# Altium schematic sheet 04-RFID.SchDoc: RFID
size A4; Engineer: Juan M Garin; Organization: ESO; Address1: Juan M Garin; DocumentNumber: 4; Revision: 1.0; SheetNumber: 4; SheetTotal: 6
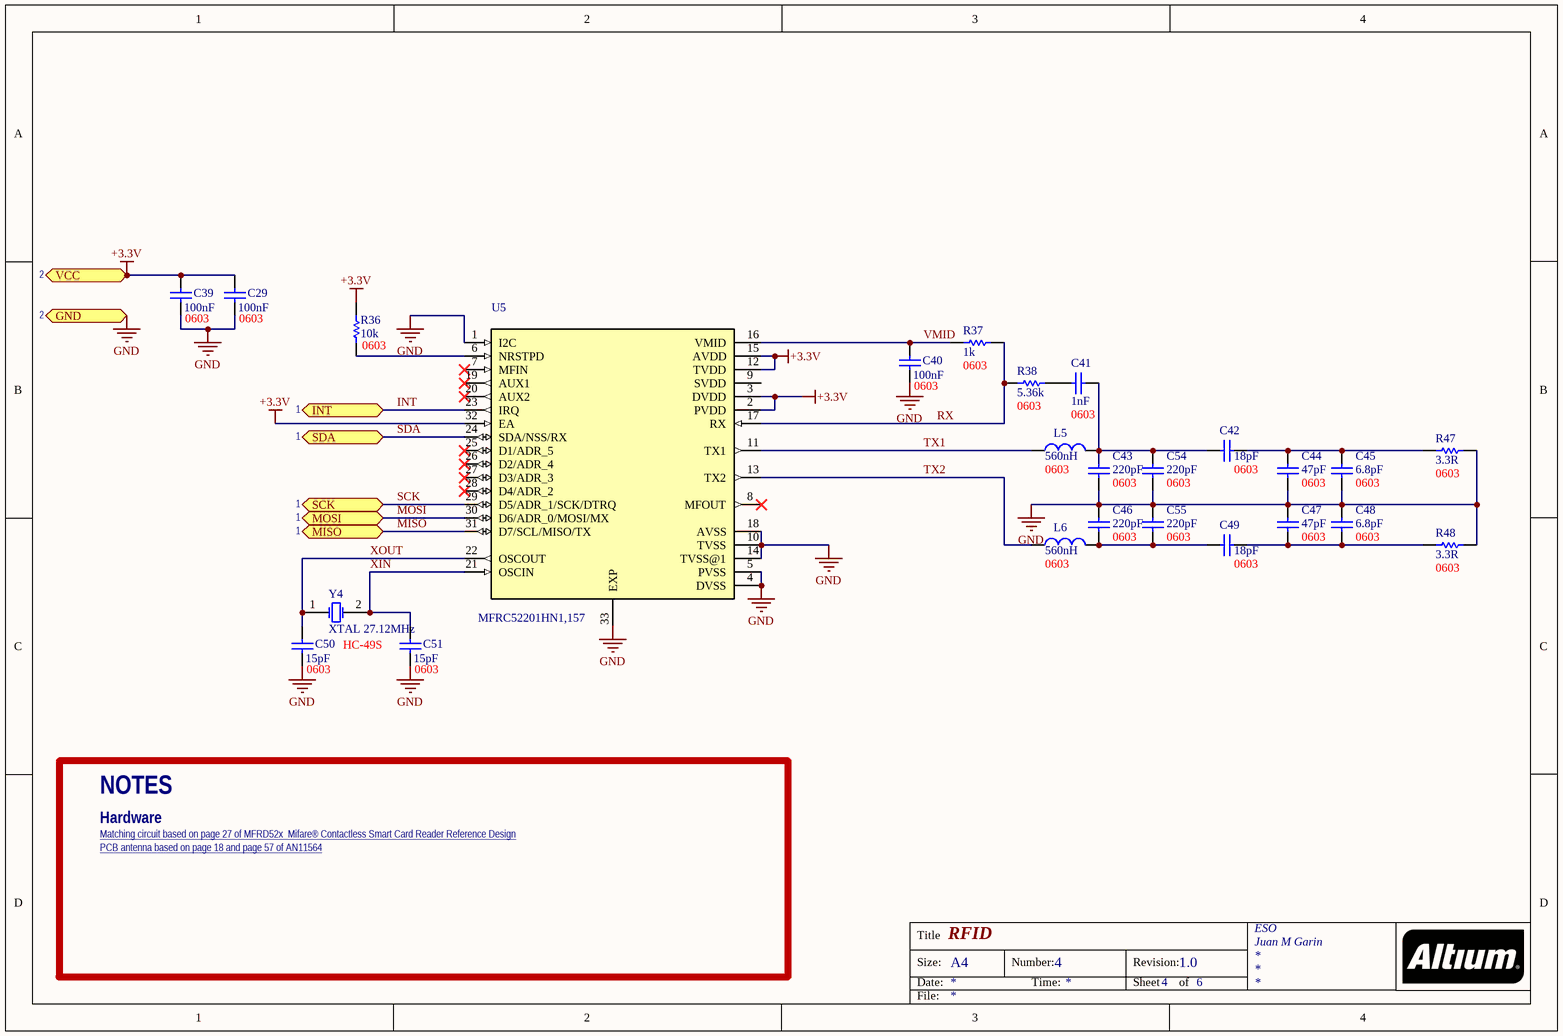
[diagram p0: 04-RFID.SchDoc]

## Parts
C29  100nF  PackageReference: 0603  [C0603]
C39  100nF  PackageReference: 0603  [C0603]
C40  100nF  PackageReference: 0603  [C0603]
C41  1nF  PackageReference: 0603  [C0603]
C42  18pF  PackageReference: 0603  [C0603]
C43  220pF  PackageReference: 0603  [C0603]
C44  47pF  PackageReference: 0603  [C0603]
C45  6.8pF  PackageReference: 0603  [C0603]
C46  220pF  PackageReference: 0603  [C0603]
C47  47pF  PackageReference: 0603  [C0603]
C48  6.8pF  PackageReference: 0603  [C0603]
C49  18pF  PackageReference: 0603  [C0603]
C50  15pF  PackageReference: 0603  [C0603]
C51  15pF  PackageReference: 0603  [C0603]
C54  220pF  PackageReference: 0603  [C0603]
C55  220pF  PackageReference: 0603  [C0603]
L5  PackageReference: 0603  [L0603]  (hidden comment: 560nH)
L6  PackageReference: 0603  [L0603]  (hidden comment: 560nH)
R36  10k  PackageReference: 0603  [R0603]
R37  1k  PackageReference: 0603  [R0603]
R38  5.36k  PackageReference: 0603  [R0603]
R47  3.3R  PackageReference: 0603  [R0603]
R48  3.3R  PackageReference: 0603  [R0603]
U5  MFRC52201HN1,157  [QFN-32_5x5_0.5]
Y4  XTAL 27.12MHz  PackageReference: HC-49S  [XTAL-SMD]

## Ports
GND, INT, MISO, MOSI, SCK, SDA, VCC

## Nets
+3.3V: C29.2 C39.2 R36.1 U5.2(PVDD) U5.3(DVDD) U5.12(TVDD) U5.15(AVDD) U5.32(EA) ; port VCC
GND: C29.1 C39.1 C40.1 C43.2 C44.2 C45.2 C46.1 C47.1 C48.1 C50.1 C51.1 C54.2 C55.1 R47.2 R48.2 U5.1(I2C) U5.4(DVSS) U5.5(PVSS) U5.10(TVSS) U5.14(TVSS@1) U5.18(AVSS) U5.33(EXP) ; port GND
INT: U5.23(IRQ) ; port INT
MISO: U5.31(D7/SCL/MISO/TX) ; port MISO
MOSI: U5.30(D6/ADR_0/MOSI/MX) ; port MOSI
RX: R37.2 R38.1 U5.17(RX)
SCK: U5.29(D5/ADR_1/SCK/DTRQ) ; port SCK
SDA: U5.24(SDA/NSS/RX) ; port SDA
TX1: L5.1 U5.11(TX1)
TX2: L6.1 U5.13(TX2)
VMID: C40.2 R37.1 U5.16(VMID)
XIN: C51.2 U5.21(OSCIN) Y4.2(OSC2)
XOUT: C50.2 U5.22(OSCOUT) Y4.1(OSC1)
NetC41_1: C41.1 C42.2 C43.1 C54.1 L5.2
NetC41_2: C41.2 R38.2
NetC42_1: C42.1 C44.1 C45.1 R47.1
NetC46_2: C46.2 C49.2 C55.2 L6.2
NetC47_2: C47.2 C48.2 C49.1 R48.1
NetR36_2: R36.2 U5.6(NRSTPD)

Not connected (* = marked no-connect by the designer): U5 7(MFIN)* 8(MFOUT)* 9(SVDD) 19(AUX1)* 20(AUX2)* 25(D1/ADR_5)* 26(D2/ADR_4)* 27(D3/ADR_3)* 28(D4/ADR_2)*

## Notes on the sheet
- 2
- 1
- NOTES
- Matching circuit based on page 27 of MFRD52x  Mifare® Contactless Smart Card Reader Reference Design
- Hardware
- PCB antenna based on page 18 and page 57 of AN11564
- Title
- Size:
- Date:
- A4
- Number:
- Time:
- Revision:
- Sheet
- of
- File:

## Library data of the parts
C29 C39 C40 = Cap Semi: Capacitor (Semiconductor SIM Model); Manufacturer Part Number: CL10F104ZO8NNNC; Value: 100nF
C41 = Cap Semi: Capacitor (Semiconductor SIM Model); Manufacturer Part Number: CL10B102JB8NNNC; Value: 1nF
C42 C49 = Cap Semi: Capacitor (Semiconductor SIM Model); Manufacturer Part Number: VJ0603A180JXACW1BC; Value: 18pF
C43 C46 C54 C55 = Cap Semi: Capacitor (Semiconductor SIM Model); Manufacturer Part Number: 885012206030; Value: 220pF
C44 C47 = Cap Semi: Capacitor (Semiconductor SIM Model); Manufacturer Part Number: 885012006021; Value: 47pF
C45 C48 = Cap Semi: Capacitor (Semiconductor SIM Model); Manufacturer Part Number: CL10C6R8DB8NNNC; Value: 6.8pF
C50 C51 = Cap Semi: Capacitor (Semiconductor SIM Model); Manufacturer Part Number: CL10C150JC8NNNC; Value: 15pF
L5 L6 = Inductor_0603: Inductor; Manufacturer Part Number: AIML-0603-R56K-T; Value: 560nH
R36 = Res1: Resistor; Manufacturer Part Number: RMCF0603FT10K0; Value: 10k
R37 = Res1: Resistor; Manufacturer Part Number: RMCF0603FG1K00; Value: 1k
R38 = Res1: Resistor; Manufacturer Part Number: CR0603-FX-5361ELF; Value: 5.36k
R47 R48 = Res1: Resistor; Manufacturer Part Number: CRGCQ0603J3R3; Value: 3.3R
U5 = MFRC52201HN1,157: MFRC52201 Series 2.5 V - 3.6 V 27.12 MHz IC Smart Card Reader - HVQFN-32; MF: NXP Semiconductors; Package: HVQFN-32 NXP Semiconductors; Manufacturer Part Number: MFRC52201HN1,157
Y4 = XTAL 16MHz: Crystal Oscillator 27.12MHz SMD; Manufacturer Part Number: 9C-27.120MAAJ-T; Value: XTAL 27.12MHz